# EAGLE design MAX7219MODULE (EAGLE 6.1)
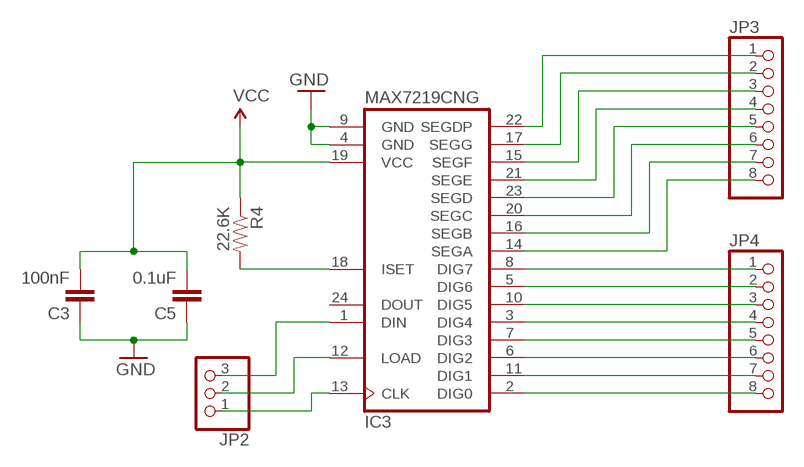
[diagram p0: schematic, sheet 1]

## Parts
C3  100nF  CAPPTH2  [CAP-PTH-SMALL2]
C5  0.1uF  CAPPTH2  [CAP-PTH-SMALL2]
IC3  MAX7219CNG  [DIL24-3]
JP2  PINHD-1X3CB  [1X03-CLEANBIG]
JP3  PINHD-1X8CLEANBIG  [1X08-CLEANBIG]
JP4  PINHD-1X8CLEANBIG  [1X08-CLEANBIG]
R4  22.6K  RESISTORPTH-1/2W  [AXIAL-0.5]

## Nets
GND: C3.1 C5.1 IC3.4(GND) IC3.9(GND)
N$1: IC3.1(DIN) JP2.3
N$2: IC3.12(LOAD) JP2.2
N$3: IC3.13(CLK) JP2.1
N$4: IC3.22(SEGDP) JP3.1
N$5: IC3.17(SEGG) JP3.2
N$6: IC3.15(SEGF) JP3.3
N$7: IC3.21(SEGE) JP3.4
N$8: IC3.23(SEGD) JP3.5
N$9: IC3.20(SEGC) JP3.6
N$10: IC3.16(SEGB) JP3.7
N$11: IC3.14(SEGA) JP3.8
N$12: IC3.8(DIG7) JP4.1
N$13: IC3.5(DIG6) JP4.2
N$14: IC3.10(DIG5) JP4.3
N$15: IC3.3(DIG4) JP4.4
N$16: IC3.7(DIG3) JP4.5
N$17: IC3.6(DIG2) JP4.6
N$18: IC3.11(DIG1) JP4.7
N$19: IC3.2(DIG0) JP4.8
N$23: IC3.18(ISET) R4.P$2
VCC: C3.2 C5.2 IC3.19(VCC) R4.P$1
Unconnected: IC3.24(DOUT)

## Library data of the parts
C3 C5 = SparkFun:CAP: Capacitor Standard 0603 ceramic capacitor, and 0.1" leaded capacitor.
IC3 = maxim:MAX7219CNG: LED DISPLAY DRIVER; MF: MAXIM; MPN: MAX7219CNG; OC_FARNELL: 1523914; OC_NEWARK: 34C4018
JP2 = adafruit:PINHD-1X3: PIN HEADER
JP3 JP4 = adafruit:PINHD-1X8: PIN HEADER
R4 = SparkFun:RESISTOR: Resistor Basic schematic elements and footprints for 0603, 1206, and PTH resistors.

## Board
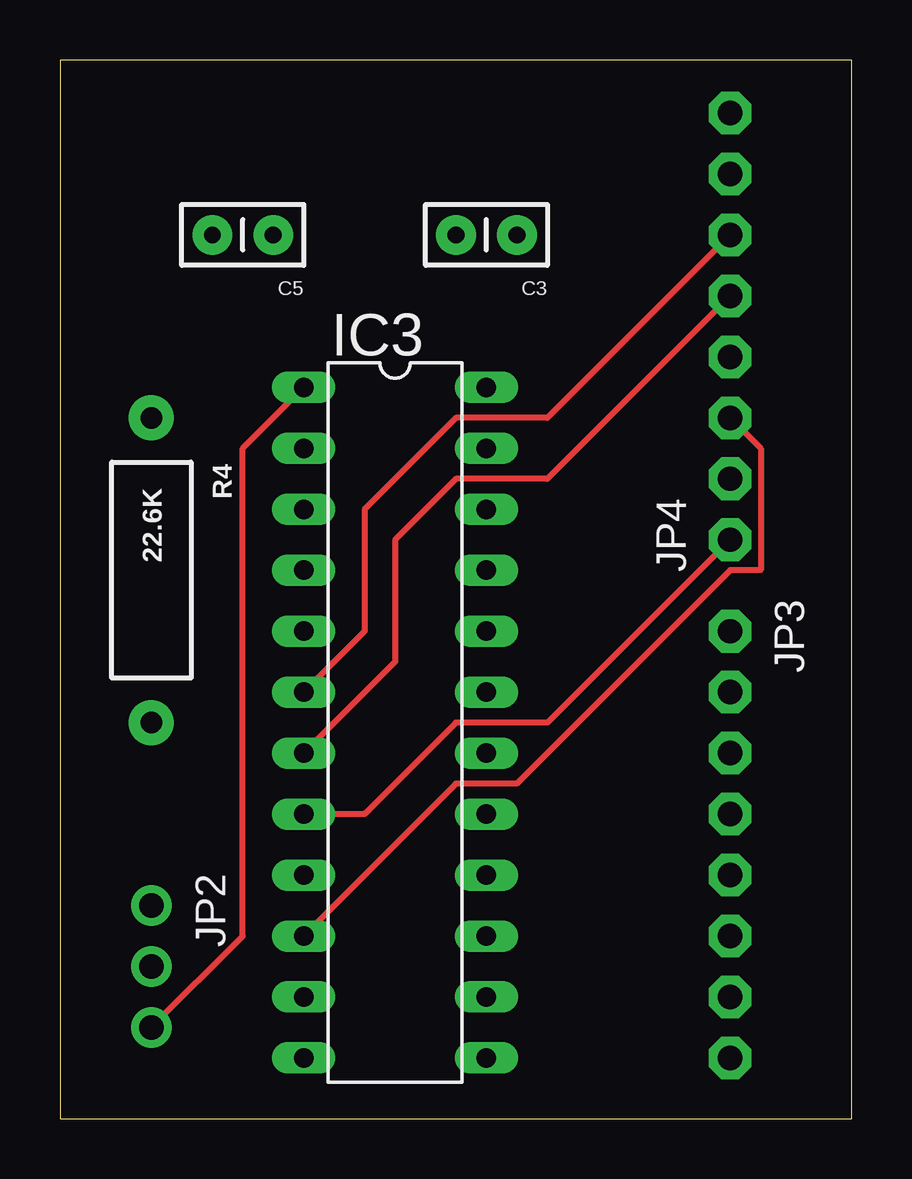
[diagram p1: board, top side]
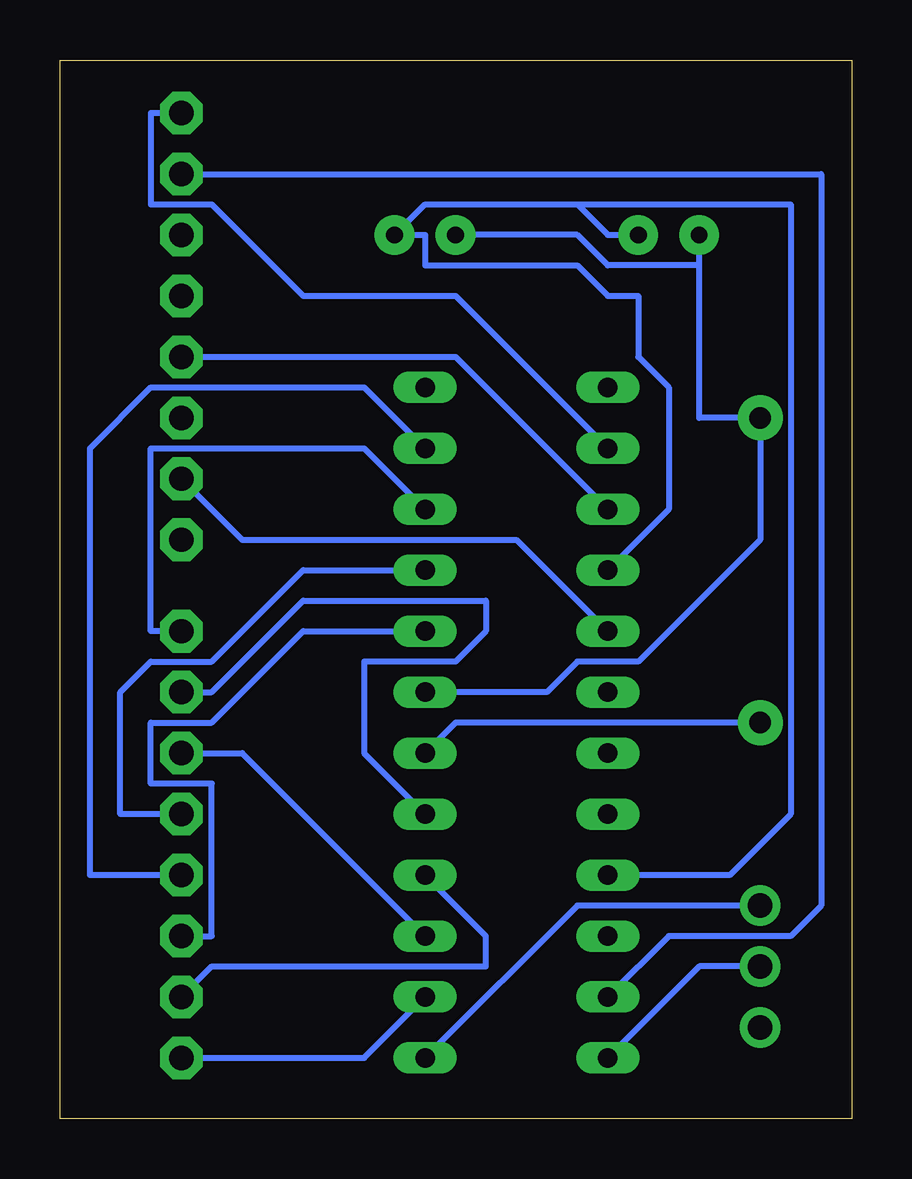
[diagram p2: board, bottom side, seen from below]

Size 33 x 44.12 mm. Coordinates in mm from the lower left corner, seen from the top.
Outline: 0,0 33,0 33,44.12 0,44.12 0,0
Copper layers (1*16): Top 0.035mm / dielectric 1.5mm / Bottom 0.035mm
Design rules: minimum track width 10mil, minimum drill 24mil, track to track 8mil, track to pad 8mil, pad to pad 8mil, via to via 8mil, smd to smd 8mil, copper to edge 40mil, drill to drill 8mil, minimum pad ring 10mil, minimum via ring 8mil, stop-mask expansion 4mil, vias tented up to drill 0mil, thermal gap 10mil

### Footprints (pad centres in the part's own frame; a part is rotated, then mirrored left to right if it is on the bottom)
CAP-PTH-SMALL2 = drill 0.7 pad 1.651: 1 0,0; 2 2.54,0
DIL24-3 = drill 0.813 long: 1 -13.97,-3.81; 2 -11.43,-3.81; 3 -8.89,-3.81; 4 -6.35,-3.81; 5 -3.81,-3.81; 6 -1.27,-3.81; 7 1.27,-3.81; 8 3.81,-3.81; 9 6.35,-3.81; 10 8.89,-3.81; 11 11.43,-3.81; 12 13.97,-3.81; 13 13.97,3.81; 14 11.43,3.81; 15 8.89,3.81; 16 6.35,3.81; 17 3.81,3.81; 18 1.27,3.81; 19 -1.27,3.81; 20 -3.81,3.81; 21 -6.35,3.81; 22 -8.89,3.81; 23 -11.43,3.81; 24 -13.97,3.81
1X03-CLEANBIG = drill 1.016 pad 1.676: 1 -2.54,0; 2 0,0; 3 2.54,0
1X08-CLEANBIG = drill 1.016 pad 1.778 octagon: 1 -8.89,0; 2 -6.35,0; 3 -3.81,0; 4 -1.27,0; 5 1.27,0; 6 3.81,0; 7 6.35,0; 8 8.89,0
AXIAL-0.5 = drill 0.9 pad 1.88: P$1 -6.35,0; P$2 6.35,0

### Placement (x,y rotation side)
C3  19.05,36.83 180 top
C5  8.89,36.83 180 top
IC3  13.97,16.51 270 top
JP2  3.81,6.35 270 top
JP3  27.94,11.43 270 top
JP4  27.94,33.02 90 top
R4  3.81,22.86 270 top

### Tracks (layer width: path | path; a pad name or v marks a point on that pad's centre or on a via)
GND
  Bottom 0.254: C5.1 10.16,36.83 11.43,38.1 | 11.43,38.1 17.78,38.1 C3.1 17.78,36.83 17.78,35.56 11.43,35.56 10.16,34.29 8.89,34.29 8.89,31.75 7.62,30.48 7.62,25.4 IC3.4 | IC3.9 5.08,10.16 2.54,12.7 2.54,38.1 11.43,38.1
N$1
  Top 0.254: IC3.1 7.62,27.94 7.62,7.62 JP2.3
N$2
  Bottom 0.254: IC3.12 6.35,6.35 JP2.2
N$3
  Bottom 0.254: IC3.13 11.43,8.89 JP2.1
N$4
  Bottom 0.254: IC3.22 20.32,27.94 29.21,27.94 29.21,20.32 JP3.1
N$5
  Bottom 0.254: IC3.17 20.32,15.24 20.32,19.05 16.51,19.05 15.24,20.32 15.24,21.59 22.86,21.59 26.67,17.78 JP3.2
N$6
  Bottom 0.254: IC3.15 25.4,15.24 JP3.3
N$7
  Bottom 0.254: IC3.21 22.86,22.86 26.67,19.05 29.21,19.05 30.48,17.78 30.48,12.7 JP3.4
N$8
  Bottom 0.254: IC3.23 20.32,30.48 29.21,30.48 31.75,27.94 31.75,10.16 JP3.5
N$9
  Bottom 0.254: IC3.20 22.86,20.32 26.67,16.51 29.21,16.51 29.21,13.97 26.67,13.97 26.67,7.62 JP3.6
N$10
  Bottom 0.254: IC3.16 15.24,7.62 15.24,6.35 26.67,6.35 JP3.7
N$11
  Bottom 0.254: IC3.14 20.32,2.54 JP3.8
N$12
  Top 0.254: IC3.8 12.7,12.7 16.51,16.51 20.32,16.51 JP4.1
N$13
  Bottom 0.254: IC3.5 13.97,24.13 25.4,24.13 JP4.2
N$14
  Top 0.254: IC3.10 16.51,13.97 19.05,13.97 27.94,22.86 29.21,22.86 29.21,27.94 JP4.3
N$15
  Bottom 0.254: IC3.3 16.51,31.75 JP4.4
N$16
  Top 0.254: IC3.7 13.97,19.05 13.97,24.13 16.51,26.67 20.32,26.67 JP4.5
N$17
  Top 0.254: IC3.6 12.7,20.32 12.7,25.4 16.51,29.21 20.32,29.21 JP4.6
N$18
  Bottom 0.254: IC3.11 7.62,7.62 2.54,7.62 1.27,8.89 1.27,39.37 JP4.7
N$19
  Bottom 0.254: IC3.2 16.51,34.29 22.86,34.29 26.67,38.1 29.21,38.1 29.21,41.91 JP4.8
N$23
  Bottom 0.254: IC3.18 16.51,16.51 R4.P$2
VCC
  Bottom 0.254: IC3.19 12.7,17.78 11.43,19.05 8.89,19.05 3.81,24.13 R4.P$1 6.35,29.21 6.35,35.56 | 6.35,35.56 C5.2 | C3.2 11.43,36.83 10.16,35.56 6.35,35.56